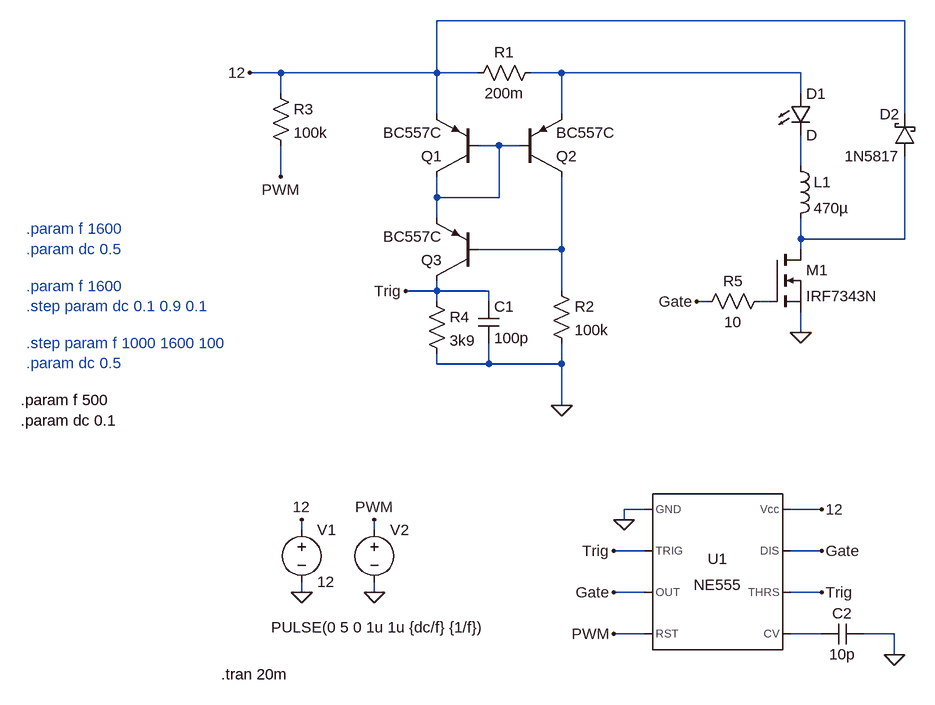
[diagram p0: schematic CurrentSource.asc]
CurrentSource.asc, the LTspice schematic file:
Version 4
SHEET 1 880 856
WIRE 592 -176 -128 -176
WIRE -368 -96 -416 -96
WIRE -128 -96 -128 -176
WIRE -128 -96 -368 -96
WIRE -64 -96 -128 -96
WIRE 64 -96 16 -96
WIRE 432 -96 64 -96
WIRE -368 -64 -368 -96
WIRE 432 -64 432 -96
WIRE -128 -32 -128 -96
WIRE 64 -32 64 -96
WIRE 592 -32 592 -176
WIRE -32 16 -64 16
WIRE 0 16 -32 16
WIRE 432 48 432 0
WIRE -368 64 -368 16
WIRE -128 96 -128 64
WIRE -32 96 -32 16
WIRE -32 96 -128 96
WIRE -128 128 -128 96
WIRE 432 160 432 128
WIRE 592 160 592 32
WIRE 592 160 432 160
WIRE 64 176 64 64
WIRE 64 176 -64 176
WIRE 432 176 432 160
WIRE -128 240 -128 224
WIRE -128 240 -176 240
WIRE -48 240 -128 240
WIRE 64 240 64 176
WIRE -128 256 -128 240
WIRE -48 256 -48 240
WIRE 288 256 272 256
WIRE 384 256 368 256
WIRE 432 304 432 272
WIRE -128 352 -128 336
WIRE -48 352 -48 320
WIRE -48 352 -128 352
WIRE 64 352 64 320
WIRE 64 352 -48 352
WIRE 64 416 64 352
WIRE 192 576 160 576
WIRE 464 576 416 576
WIRE 160 592 160 576
WIRE -336 608 -336 592
WIRE -224 608 -224 592
WIRE 192 640 144 640
WIRE 464 640 416 640
WIRE -336 704 -336 688
WIRE -224 704 -224 688
WIRE 192 704 144 704
WIRE 464 704 416 704
WIRE 192 768 144 768
WIRE 464 768 416 768
WIRE 576 768 528 768
WIRE 576 800 576 768
FLAG -336 704 0
FLAG -336 592 12
FLAG -224 704 0
FLAG -224 592 PWM
FLAG 160 592 0
FLAG 64 416 0
FLAG -416 -96 12
FLAG 464 640 Gate
FLAG 272 256 Gate
FLAG 144 704 Gate
FLAG 464 576 12
FLAG 144 640 Trig
FLAG 464 704 Trig
FLAG 144 768 PWM
FLAG -368 64 PWM
FLAG -176 240 Trig
FLAG 432 304 0
FLAG 576 800 0
SYMBOL voltage -336 592 R0
WINDOW 123 0 0 Left 0
WINDOW 39 0 0 Left 0
SYMATTR InstName V1
SYMATTR Value 12
SYMBOL voltage -224 592 R0
WINDOW 3 -159 166 Left 2
WINDOW 123 0 0 Left 0
WINDOW 39 0 0 Left 0
SYMATTR InstName V2
SYMATTR Value PULSE(0 5 0 1u 1u {dc/f} {1/f})
SYMBOL Misc\\NE555 304 672 R0
SYMATTR InstName U1
SYMBOL ind 416 32 R0
SYMATTR InstName L1
SYMATTR Value 470µ
SYMBOL pnp -64 64 R180
SYMATTR InstName Q1
SYMATTR Value BC557C
SYMBOL pnp 0 64 M180
SYMATTR InstName Q2
SYMATTR Value BC557C
SYMBOL pnp -64 224 R180
SYMATTR InstName Q3
SYMATTR Value BC557C
SYMBOL res 32 -112 R90
WINDOW 0 0 56 VBottom 2
WINDOW 3 32 56 VTop 2
SYMATTR InstName R1
SYMATTR Value 200m
SYMBOL res 48 224 R0
SYMATTR InstName R2
SYMATTR Value 100k
SYMBOL res -384 -80 R0
SYMATTR InstName R3
SYMATTR Value 100k
SYMBOL res -144 240 R0
SYMATTR InstName R4
SYMATTR Value 3k9
SYMBOL cap -64 256 R0
SYMATTR InstName C1
SYMATTR Value 100p
SYMBOL LED 416 -64 R0
SYMATTR InstName D1
SYMBOL schottky 608 32 R180
WINDOW 0 24 64 Left 2
WINDOW 3 24 0 Left 2
SYMATTR InstName D2
SYMATTR Value 1N5817
SYMATTR Description Diode
SYMATTR Type diode
SYMBOL cap 464 784 R270
WINDOW 0 32 32 VTop 2
WINDOW 3 0 32 VBottom 2
SYMATTR InstName C2
SYMATTR Value 10p
SYMBOL res 384 240 R90
WINDOW 0 0 56 VBottom 2
WINDOW 3 32 56 VTop 2
SYMATTR InstName R5
SYMATTR Value 10
SYMBOL nmos 384 176 R0
SYMATTR InstName M1
SYMATTR Value IRF7343N
TEXT -460 830 Left 2 !.tran 20m
TEXT -760 144 Left 2 ;.param f 1600\n.param dc 0.5
TEXT -760 232 Left 2 ;.param f 1600\n.step param dc 0.1 0.9 0.1
TEXT -760 320 Left 2 ;.step param f 1000 1600 100\n.param dc 0.5
TEXT -768 408 Left 2 !.param f 500\n.param dc 0.1

The netlist it stands for:
* CurrentSource.asc
V1 12 0 12
V2 PWM 0 PULSE(0 5 0 1u 1u {dc/f} {1/f})
XU1 0 Trig Gate PWM N007 Trig Gate 12 NE555  ; pins GND TRIG OUT RST CV THRS DIS Vcc
L1 N003 N004 470µ
Q1 N002 N002 12 0 BC557C
Q2 N005 N002 N001 0 BC557C
Q3 Trig N005 N002 0 BC557C
R1 N001 12 200m
R2 N005 0 100k
R3 12 PWM 100k
R4 Trig 0 3k9
C1 Trig 0 100p
D1 N001 N003 D
D2 N004 12 1N5817
C2 N007 0 10p
R5 N006 Gate 10
M1 N004 N006 0 0 IRF7343N
.model D D
.lib standard.dio
.model NPN NPN
.model PNP PNP
.lib standard.bjt
.model NMOS NMOS
.model PMOS PMOS
.lib standard.mos
.tran 20m
* .param f 1600
* .param dc 0.5
* .param f 1600
* .step param dc 0.1 0.9 0.1
* .step param f 1000 1600 100
* .param dc 0.5
.param f 500
.param dc 0.1
.lib NE555.sub
.backanno
.end